# Altium schematic sheet IO.SchDoc
size A4
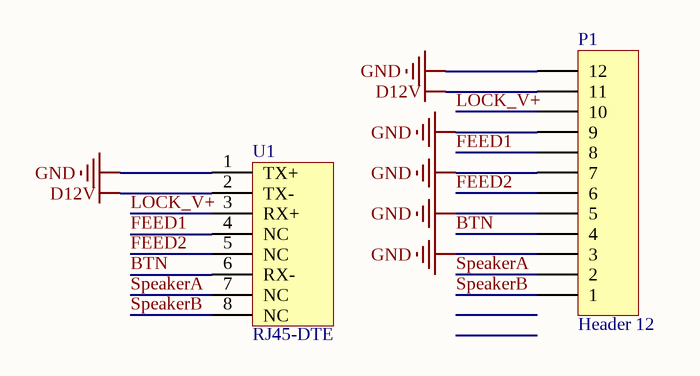
[diagram p0: IO.SchDoc]

## Parts
P1  Header 12  [KF128-3.81-12]
U1  RJ45-DTE  [RJ45]

## Nets
D12V: P1.11 U1.2(TX-)
GND: P1.3 P1.5 P1.7 P1.9 P1.12 U1.1(TX+)
BTN: P1.4 U1.6(RX-)
FEED1: P1.8 U1.4(NC)
FEED2: P1.6 U1.5(NC)
LOCK_V+: P1.10 U1.3(RX+)
SpeakerA: P1.2 U1.7(NC)
SpeakerB: P1.1 U1.8(NC)

## Library data of the parts
P1 = Header 12: Header, 12-Pin; LatestRevisionDate: 17-Jul-2002; LatestRevisionNote: Re-released for DXP Platform.; Publisher: Altium Limited